# Altium project 智能路灯工程.PrjPcb
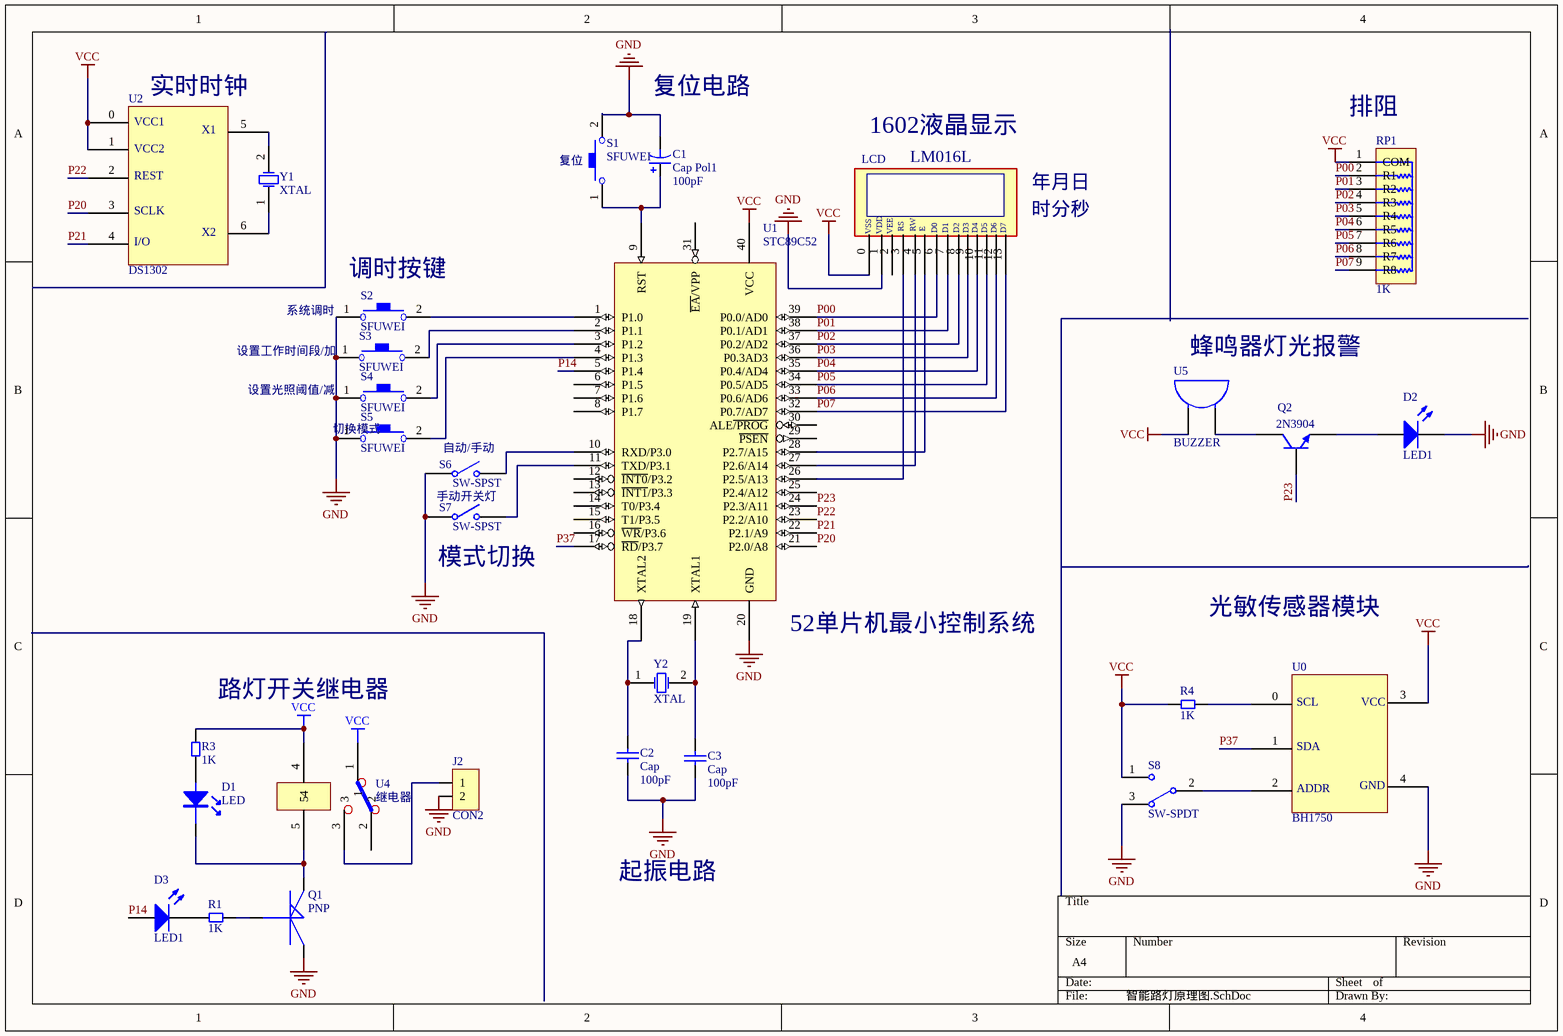
[diagram p0: 智能路灯原理图.SchDoc]
1 sheet, 29 parts. Net scope: global (net labels, ports and power ports of the same name join across sheets).

## Sheet 智能路灯原理图.SchDoc
size A4

### Parts
?  LCD
C1  Cap Pol1  value 100pF  [RB7.6-15]
C2  Cap  value 100pF  [RAD-0.3]
C3  Cap  value 100pF  [RAD-0.3]
D1  LED  [LED0.1]
D2  LED1  [LED-1]
D3  LED1  [LED-1]
J2  CON2  [SIP2]
Q1  PNP  [85501]
Q2  2N3904  [TO-92A]
R1  1K  [AXIAL0.3]
R3  1K  [AXIAL0.3]
R4  1K  [AXIAL0.3]
RP1  1K  [SIP9]
S1  SFUWEI  [SFuWei]
S2  SFUWEI  [SFuWei]
S3  SFUWEI  [SFuWei]
S4  SFUWEI  [SFuWei]
S5  SFUWEI  [SFuWei]
S6  SW-SPST  [SPST-2]
S7  SW-SPST  [SPST-2]
S8  SW-SPDT  [TL36WW15050]
U0  BH1750
U1  STC89C52  [DIP40]
U2  DS1302
U4  继电器  [JDQ]
U5  BUZZER  [BUZZER1]
Y1  XTAL  [R38]
Y2  XTAL  [R38]

### Nets
GND: ?.1 C1.2 C2.1 C3.1 D2.2(K) J2.2 Q1.3 S1.2 S2.1 S3.1 S4.1 S5.1 S6.1(COMMON) S7.1(COMMON) S8.3 U0.4 U1.20(GND)
VCC: ?.0 R3.2 R4.2 RP1.1(COM) S8.1 U0.3 U1.40(VCC) U2.0 U2.1 U4.1 U4.4 U5.1(A)
P00: ?.6 RP1.2(R1) U1.39(P0.0/AD0)
P01: ?.7 RP1.3(R2) U1.38(P0.1/AD1)
P02: ?.8 RP1.4(R3) U1.37(P0.2/AD2)
P03: ?.9 RP1.5(R4) U1.36(P0.3AD3)
P04: ?.10 RP1.6(R5) U1.35(P0.4/AD4)
P05: ?.11 RP1.7(R6) U1.34(P0.5/AD5)
P06: ?.12 RP1.8(R7) U1.33(P0.6/AD6)
P07: ?.13 RP1.9(R8) U1.32(P0.7/AD7)
P14: D3.1(A) U1.5(P1.4)
P20: U1.21(P2.0/A8) U2.3
P21: U1.22(P2.1/A9) U2.4
P22: U1.23(P2.2/A10) U2.2
P23: Q2.2(B) U1.24(P2.3/A11)
P37: U0.1 U1.17(~{RD}/P3.7)
Net?_3: ?.3 U1.26(P2.5/A13)
Net?_4: ?.4 U1.27(P2.6/A14)
Net?_5: ?.5 U1.28(P2.7/A15)
NetC1_1: C1.1 S1.1 U1.9(RST)
NetC2_2: C2.2 U1.18(XTAL2) Y2.1(OSC1)
NetC3_2: C3.2 U1.19(XTAL1) Y2.2(OSC2)
NetD1_1: D1.1 R3.1
NetD1_2: D1.2 Q1.1 U4.5
NetD2_1: D2.1(A) Q2.1(E)
NetD3_2: D3.2(K) R1.1
NetJ2_1: J2.1 U4.3
NetQ1_2: Q1.2 R1.2
NetQ2_3: Q2.3(C) U5.2(B)
NetR4_1: R4.1 U0.0
NetS2_2: S2.2 U1.1(P1.0)
NetS3_2: S3.2 U1.2(P1.1)
NetS4_2: S4.2 U1.3(P1.2)
NetS5_2: S5.2 U1.4(P1.3)
NetS6_2: S6.2(NO) U1.10(RXD/P3.0)
NetS7_2: S7.2(NO) U1.11(TXD/P3.1)
NetS8_2: S8.2 U0.2
NetU2_5: U2.5 Y1.2(OSC2)
NetU2_6: U2.6 Y1.1(OSC1)

Not connected (* = marked no-connect by the designer): ? 2; U1 6(P1.5) 7(P1.6) 8(P1.7) 12(~{INT0}/P3.2) 13(~{INT1}/P3.3) 14(T0/P3.4) 15(T1/P3.5) 16(~{WR}/P3.6) 25(P2.4/A12) 29(~{PSEN}) 30(ALE~{/PROG}) 31(~{EA}/VPP); U4 2

### Notes on the sheet
- (near U2) 实时时钟
- 复位电路
- (near S1) 复位
- 1602液晶显示
- LM016L
- (near RP1) 排阻
- 年月日
- 时分秒
- 系统调时
- (near S2) 调时按键
- 设置工作时间段/加
- (near U5) 蜂鸣器灯光报警
- 设置光照阈值/减
- 切换模式
- (near S6) 自动/手动
- 手动开关灯
- (near S7) 模式切换
- (near U1) 52单片机最小控制系统
- 光敏传感器模块
- (near R3) 路灯开关继电器
- 起振电路
- (in symbol BH1750) SCL; VCC; SDA; ADDR; GND
- (in symbol DS1302) VCC1; X1; VCC2; REST; SCLK; X2; I/O
- (in symbol LCD) VSS; VDD; VEE; RS; RW; E; D0; D1; D2; D3; D4; D5; D6; D7

### Library data of the parts
C1 = Cap Pol1: Polarized Capacitor (Radial); Published: 8-Jun-2000; LatestRevisionDate: 17-Jul-2002; LatestRevisionNote: Re-released for DXP Platform.; PackageReference: RB7.6-15; Publisher: Altium Limited
C2 C3 = Cap: Capacitor; Published: 8-Jun-2000; LatestRevisionDate: 17-Jul-2002; LatestRevisionNote: Re-released for DXP Platform.; PackageReference: RAD-0.3; Publisher: Altium Limited
D2 D3 = LED1: Typical RED GaAs LED; Published: 8-Jun-2000; LatestRevisionDate: 08-Jul-2005; LatestRevisionNote: Mech Layer 1 removed.; PackageReference: LED-1; Publisher: Altium Limited
J2 = CON2: Connector
Q1 = PNP: NPN Transistor
Q2 = 2N3904: NPN General Purpose Amplifier; Published: 8-Jun-2000; LatestRevisionDate: 15-Jan-2003; LatestRevisionNote: PCB Footprint 'BCY-W3/D4.7' replaced; DatasheetDocument: 1997; PackageDocument: Sep-1998; PackageReference: TO-92A; Publisher: Altium Limited; Code_JEDEC: TO-92A; ComponentLink1Description: Manufacturer Link; ComponentLink1URL: http://www.fairchildsemi.com/; ComponentLink2Description: Datasheet; ComponentLink2URL: http://www.fairchildsemi.com/ds/2N%2F2N3904.pdf
R1 R3 R4 = RES2
RP1 = RP8
S6 S7 = SW-SPST: Single-Pole, Single-Throw Switch; Published: 24-Mar-1999; LatestRevisionDate: 17-Jul-2002; LatestRevisionNote: Re-released for DXP Platform.; PackageReference: SPST-2; Publisher: Altium Limited
S8 = SW-SPDT: SPDT Subminiature Toggle Switch, Right Angle Mounting, Vertical Actuation; Published: 24-Mar-1999; LatestRevisionDate: 17-Dec-2003; LatestRevisionNote: Schematic revised, PCB Footprint replaced.; DatasheetDocument: 05-Dec-2000; PackageReference: TL36WW15050; Publisher: Altium Limited; ComponentLink1Description: Manufacturer Link; ComponentLink1URL: http://www.apem.com
U1 = Component_1
U4 = 继电器: Variable Capacitor
Y1 Y2 = XTAL: Crystal Oscillator; Published: 8-Jun-2000; LatestRevisionDate: 17-Jul-2002; LatestRevisionNote: Re-released for DXP Platform.; PackageReference: R38; Publisher: Altium Limited